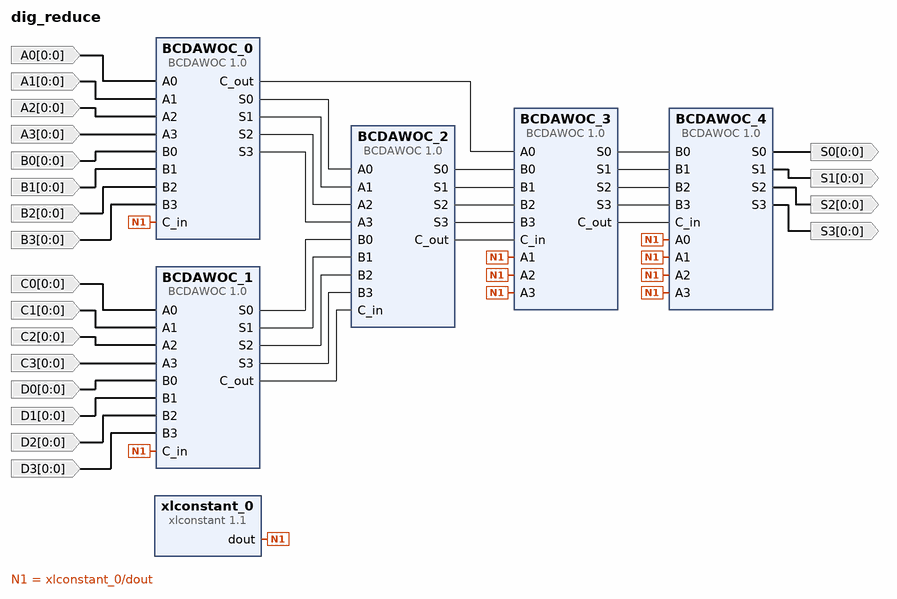
[diagram p0: block diagram of the top level]
# Vivado block design dig_reduce, xc7vx485tffg1157-1, Vivado 2019.1
create_bd_design dig_reduce

create_bd_port -dir I -from 0 -to 0 A0
create_bd_port -dir I -from 0 -to 0 A1
create_bd_port -dir I -from 0 -to 0 A2
create_bd_port -dir I -from 0 -to 0 A3
create_bd_port -dir I -from 0 -to 0 B0
create_bd_port -dir I -from 0 -to 0 B1
create_bd_port -dir I -from 0 -to 0 B2
create_bd_port -dir I -from 0 -to 0 B3
create_bd_port -dir I -from 0 -to 0 C0
create_bd_port -dir I -from 0 -to 0 C1
create_bd_port -dir I -from 0 -to 0 C2
create_bd_port -dir I -from 0 -to 0 C3
create_bd_port -dir I -from 0 -to 0 D0
create_bd_port -dir I -from 0 -to 0 D1
create_bd_port -dir I -from 0 -to 0 D2
create_bd_port -dir I -from 0 -to 0 D3
create_bd_port -dir O -from 0 -to 0 S0
create_bd_port -dir O -from 0 -to 0 S1
create_bd_port -dir O -from 0 -to 0 S2
create_bd_port -dir O -from 0 -to 0 S3

create_bd_cell -type ip -vlnv Group5:user:BCDAWOC:1.0 BCDAWOC_0
create_bd_cell -type ip -vlnv Group5:user:BCDAWOC:1.0 BCDAWOC_1
create_bd_cell -type ip -vlnv xilinx.com:ip:xlconstant:1.1 xlconstant_0
set_property -dict {CONFIG.CONST_VAL 0} [get_bd_cells xlconstant_0]
create_bd_cell -type ip -vlnv Group5:user:BCDAWOC:1.0 BCDAWOC_2
create_bd_cell -type ip -vlnv Group5:user:BCDAWOC:1.0 BCDAWOC_3
create_bd_cell -type ip -vlnv Group5:user:BCDAWOC:1.0 BCDAWOC_4

# ---- connections ----

connect_bd_net -net A0_1 [get_bd_ports A0] [get_bd_pins BCDAWOC_0/A0]
connect_bd_net -net A1_1 [get_bd_ports A1] [get_bd_pins BCDAWOC_0/A1]
connect_bd_net -net A2_1 [get_bd_ports A2] [get_bd_pins BCDAWOC_0/A2]
connect_bd_net -net A3_1 [get_bd_ports A3] [get_bd_pins BCDAWOC_0/A3]
connect_bd_net -net B0_1 [get_bd_ports B0] [get_bd_pins BCDAWOC_0/B0]
connect_bd_net -net B1_1 [get_bd_ports B1] [get_bd_pins BCDAWOC_0/B1]
connect_bd_net -net B2_1 [get_bd_ports B2] [get_bd_pins BCDAWOC_0/B2]
connect_bd_net -net B3_1 [get_bd_ports B3] [get_bd_pins BCDAWOC_0/B3]
connect_bd_net -net C0_1 [get_bd_ports C0] [get_bd_pins BCDAWOC_1/A0]
connect_bd_net -net C1_1 [get_bd_ports C1] [get_bd_pins BCDAWOC_1/A1]
connect_bd_net -net C2_1 [get_bd_ports C2] [get_bd_pins BCDAWOC_1/A2]
connect_bd_net -net C3_1 [get_bd_ports C3] [get_bd_pins BCDAWOC_1/A3]
connect_bd_net -net D0_1 [get_bd_ports D0] [get_bd_pins BCDAWOC_1/B0]
connect_bd_net -net D1_1 [get_bd_ports D1] [get_bd_pins BCDAWOC_1/B1]
connect_bd_net -net D2_1 [get_bd_ports D2] [get_bd_pins BCDAWOC_1/B2]
connect_bd_net -net D3_1 [get_bd_ports D3] [get_bd_pins BCDAWOC_1/B3]
connect_bd_net [get_bd_pins xlconstant_0/dout] \
  [get_bd_pins BCDAWOC_0/C_in] [get_bd_pins BCDAWOC_1/C_in] [get_bd_pins BCDAWOC_3/A1] [get_bd_pins BCDAWOC_3/A2] \
  [get_bd_pins BCDAWOC_3/A3] [get_bd_pins BCDAWOC_4/A0] [get_bd_pins BCDAWOC_4/A1] [get_bd_pins BCDAWOC_4/A2] \
  [get_bd_pins BCDAWOC_4/A3]
connect_bd_net [get_bd_pins BCDAWOC_0/S0] [get_bd_pins BCDAWOC_2/A0]
connect_bd_net [get_bd_pins BCDAWOC_0/S1] [get_bd_pins BCDAWOC_2/A1]
connect_bd_net [get_bd_pins BCDAWOC_0/S2] [get_bd_pins BCDAWOC_2/A2]
connect_bd_net [get_bd_pins BCDAWOC_0/S3] [get_bd_pins BCDAWOC_2/A3]
connect_bd_net [get_bd_pins BCDAWOC_1/S0] [get_bd_pins BCDAWOC_2/B0]
connect_bd_net [get_bd_pins BCDAWOC_1/S1] [get_bd_pins BCDAWOC_2/B1]
connect_bd_net [get_bd_pins BCDAWOC_1/S2] [get_bd_pins BCDAWOC_2/B2]
connect_bd_net [get_bd_pins BCDAWOC_1/S3] [get_bd_pins BCDAWOC_2/B3]
connect_bd_net [get_bd_pins BCDAWOC_1/C_out] [get_bd_pins BCDAWOC_2/C_in]
connect_bd_net [get_bd_pins BCDAWOC_0/C_out] [get_bd_pins BCDAWOC_3/A0]
connect_bd_net [get_bd_pins BCDAWOC_2/S0] [get_bd_pins BCDAWOC_3/B0]
connect_bd_net [get_bd_pins BCDAWOC_2/S1] [get_bd_pins BCDAWOC_3/B1]
connect_bd_net [get_bd_pins BCDAWOC_2/S2] [get_bd_pins BCDAWOC_3/B2]
connect_bd_net [get_bd_pins BCDAWOC_2/S3] [get_bd_pins BCDAWOC_3/B3]
connect_bd_net [get_bd_pins BCDAWOC_2/C_out] [get_bd_pins BCDAWOC_3/C_in]
connect_bd_net [get_bd_pins BCDAWOC_3/S0] [get_bd_pins BCDAWOC_4/B0]
connect_bd_net [get_bd_pins BCDAWOC_3/S1] [get_bd_pins BCDAWOC_4/B1]
connect_bd_net [get_bd_pins BCDAWOC_3/S2] [get_bd_pins BCDAWOC_4/B2]
connect_bd_net [get_bd_pins BCDAWOC_3/S3] [get_bd_pins BCDAWOC_4/B3]
connect_bd_net [get_bd_pins BCDAWOC_3/C_out] [get_bd_pins BCDAWOC_4/C_in]
connect_bd_net [get_bd_pins BCDAWOC_4/S0] [get_bd_ports S0]
connect_bd_net [get_bd_pins BCDAWOC_4/S1] [get_bd_ports S1]
connect_bd_net [get_bd_pins BCDAWOC_4/S2] [get_bd_ports S2]
connect_bd_net [get_bd_pins BCDAWOC_4/S3] [get_bd_ports S3]

validate_bd_design
save_bd_design
